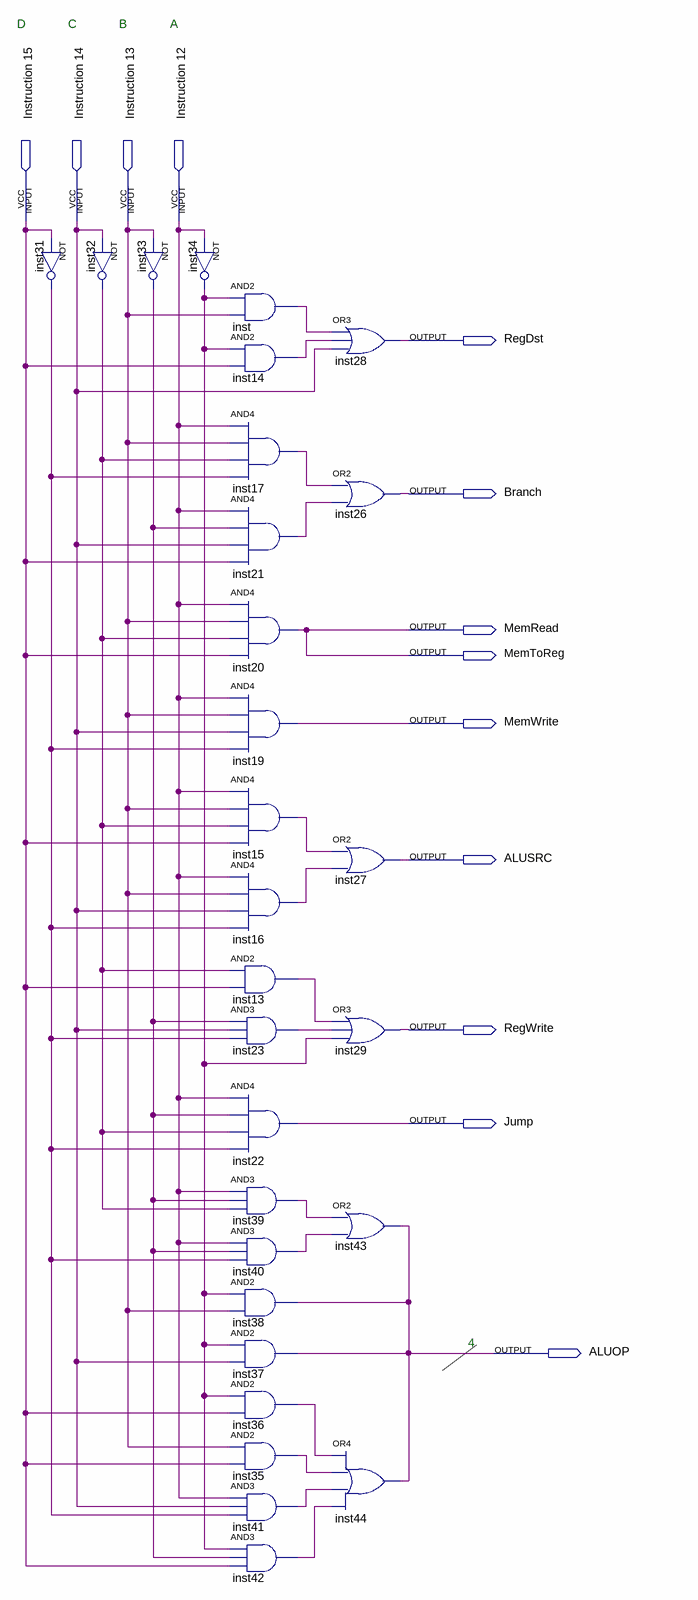
[diagram p0: schematic sheet]
// Quartus schematic Project2.bdf as structural Verilog: 29 symbols, 13 pins
module Project2 (
  input  \Instruction_15 ,
  input  \Instruction_14 ,
  input  \Instruction_13 ,
  input  \Instruction_12 ,
  output RegDst,
  output Branch,
  output MemRead,
  output MemToReg,
  output MemWrite,
  output ALUSRC,
  output RegWrite,
  output Jump,
  output ALUOP
);

  wire inst13_out, inst14_out, inst15_out, inst16_out, inst17_out, inst21_out, inst23_out, inst31_out,
       inst32_out, inst33_out, inst34_out, inst35_out, inst36_out, inst39_out, inst40_out, inst41_out,
       inst42_out, inst_out;

  not inst31 (inst31_out, \Instruction_15 );
  not inst32 (inst32_out, \Instruction_14 );
  not inst33 (inst33_out, \Instruction_13 );
  not inst34 (inst34_out, \Instruction_12 );
  and inst (inst_out, inst34_out, \Instruction_13 );
  and inst14 (inst14_out, inst34_out, \Instruction_15 );
  and inst17 (inst17_out, \Instruction_12 , \Instruction_13 , inst32_out, inst31_out);
  and inst21 (inst21_out, \Instruction_12 , inst33_out, \Instruction_14 , \Instruction_15 );
  and inst20 (MemRead, \Instruction_12 , \Instruction_13 , inst32_out, \Instruction_15 );
  and inst19 (MemWrite, \Instruction_12 , \Instruction_13 , \Instruction_14 , inst31_out);
  and inst15 (inst15_out, \Instruction_12 , \Instruction_13 , inst32_out, \Instruction_15 );
  and inst16 (inst16_out, \Instruction_12 , \Instruction_13 , \Instruction_14 , inst31_out);
  and inst13 (inst13_out, inst32_out, \Instruction_15 );
  and inst23 (inst23_out, inst33_out, \Instruction_14 , inst31_out);
  and inst22 (Jump, \Instruction_12 , inst33_out, inst32_out, inst31_out);
  and inst39 (inst39_out, \Instruction_12 , inst33_out, inst32_out);
  and inst40 (inst40_out, \Instruction_12 , inst33_out, inst31_out);
  and inst38 (ALUOP, inst34_out, \Instruction_13 );
  and inst37 (ALUOP, inst34_out, \Instruction_14 );
  and inst36 (inst36_out, inst34_out, \Instruction_15 );
  and inst35 (inst35_out, \Instruction_13 , \Instruction_15 );
  and inst41 (inst41_out, \Instruction_12 , \Instruction_14 , inst31_out);
  and inst42 (inst42_out, inst34_out, inst33_out, \Instruction_15 );
  or inst28 (RegDst, inst_out, inst14_out, \Instruction_14 );
  or inst26 (Branch, inst17_out, inst21_out);
  or inst27 (ALUSRC, inst15_out, inst16_out);
  or inst29 (RegWrite, inst13_out, inst23_out, inst34_out);
  or inst43 (ALUOP, inst39_out, inst40_out);
  or inst44 (ALUOP, inst36_out, inst35_out, inst41_out, inst42_out);

  assign MemToReg = MemRead;

  // Notes on the sheet:
  //   D
  //   C
  //   B
  //   A
  //   4
endmodule
